# EAGLE schematic A3901 (EAGLE 7.1.0)
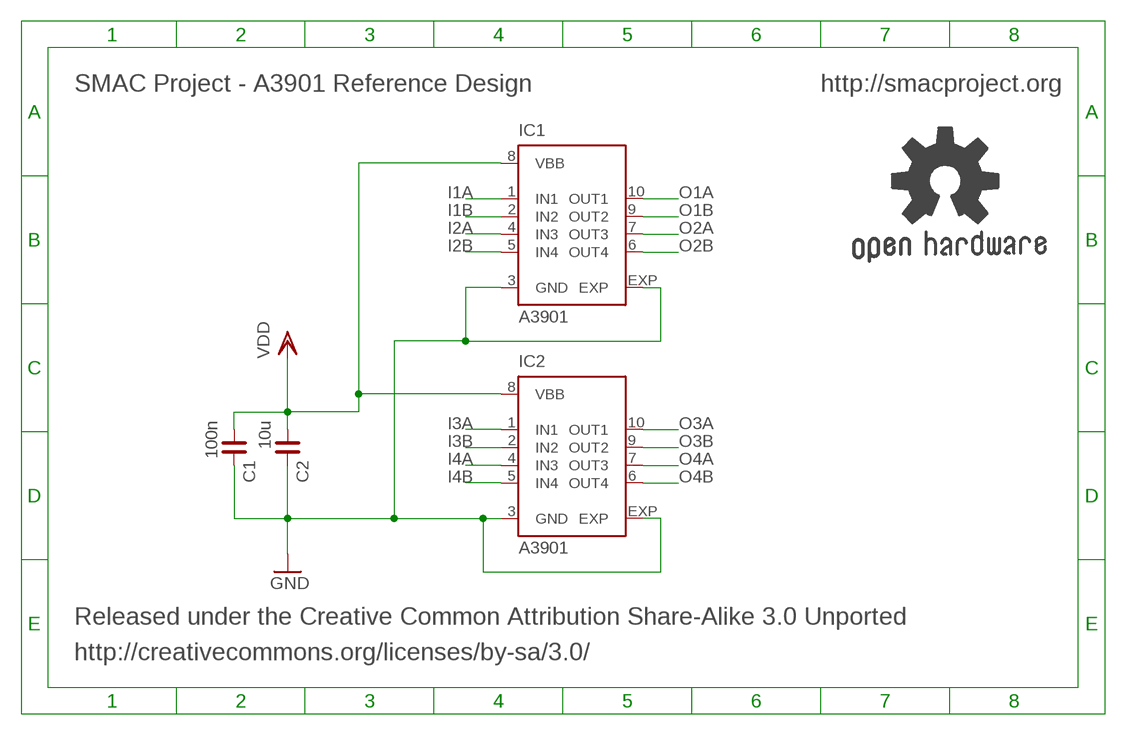
[diagram p0: schematic, sheet 1]

## Parts
C1  100n  C_0402  [C0402]
C2  10u  C_0402  [C0402]
GOLD_ORB_SM1  OSHWLOGO_REF_SM  [OSHW2REF]
IC1  A3901  [DFN10-3X3]
IC2  A3901  [DFN10-3X3]

## Nets
GND: C1.2 C2.2 IC1.3(GND) IC1.EXP IC2.3(GND) IC2.EXP
I1A: IC1.1(IN1)
I1B: IC1.2(IN2)
I2A: IC1.4(IN3)
I2B: IC1.5(IN4)
I3A: IC2.1(IN1)
I3B: IC2.2(IN2)
I4A: IC2.4(IN3)
I4B: IC2.5(IN4)
O1A: IC1.10(OUT1)
O1B: IC1.9(OUT2)
O2A: IC1.7(OUT3)
O2B: IC1.6(OUT4)
O3A: IC2.10(OUT1)
O3B: IC2.9(OUT2)
O4A: IC2.7(OUT3)
O4B: IC2.6(OUT4)
VDD: C1.1 C2.1 IC1.8(VBB) IC2.8(VBB)

## Notes on the sheet
- SMAC Project - A3901 Reference Design | http://smacproject.org
- Released under the Creative Common Attribution Share-Alike 3.0 Unported
- http://creativecommons.org/licenses/by-sa/3.0/

## Library data of the parts
C1 C2 = rc-master-smd:C_: NON-POLARIZED CAP
GOLD_ORB_SM1 = bfl:OSHWLOGO: These are Open-Source Hardware logos.
IC1 IC2 = Allegro:A3901: Dual Full Bridge Low Voltage Motor Driver Source: www.allegromicro.com .. 3901.pdf; MPN: A3901SEJTR-T; OC_FARNELL: 1651947; OC_NEWARK: 87K3379